# Altium schematic sheet USB_C.SchDoc
size A4; SheetNumber: 3; SheetTotal: 3
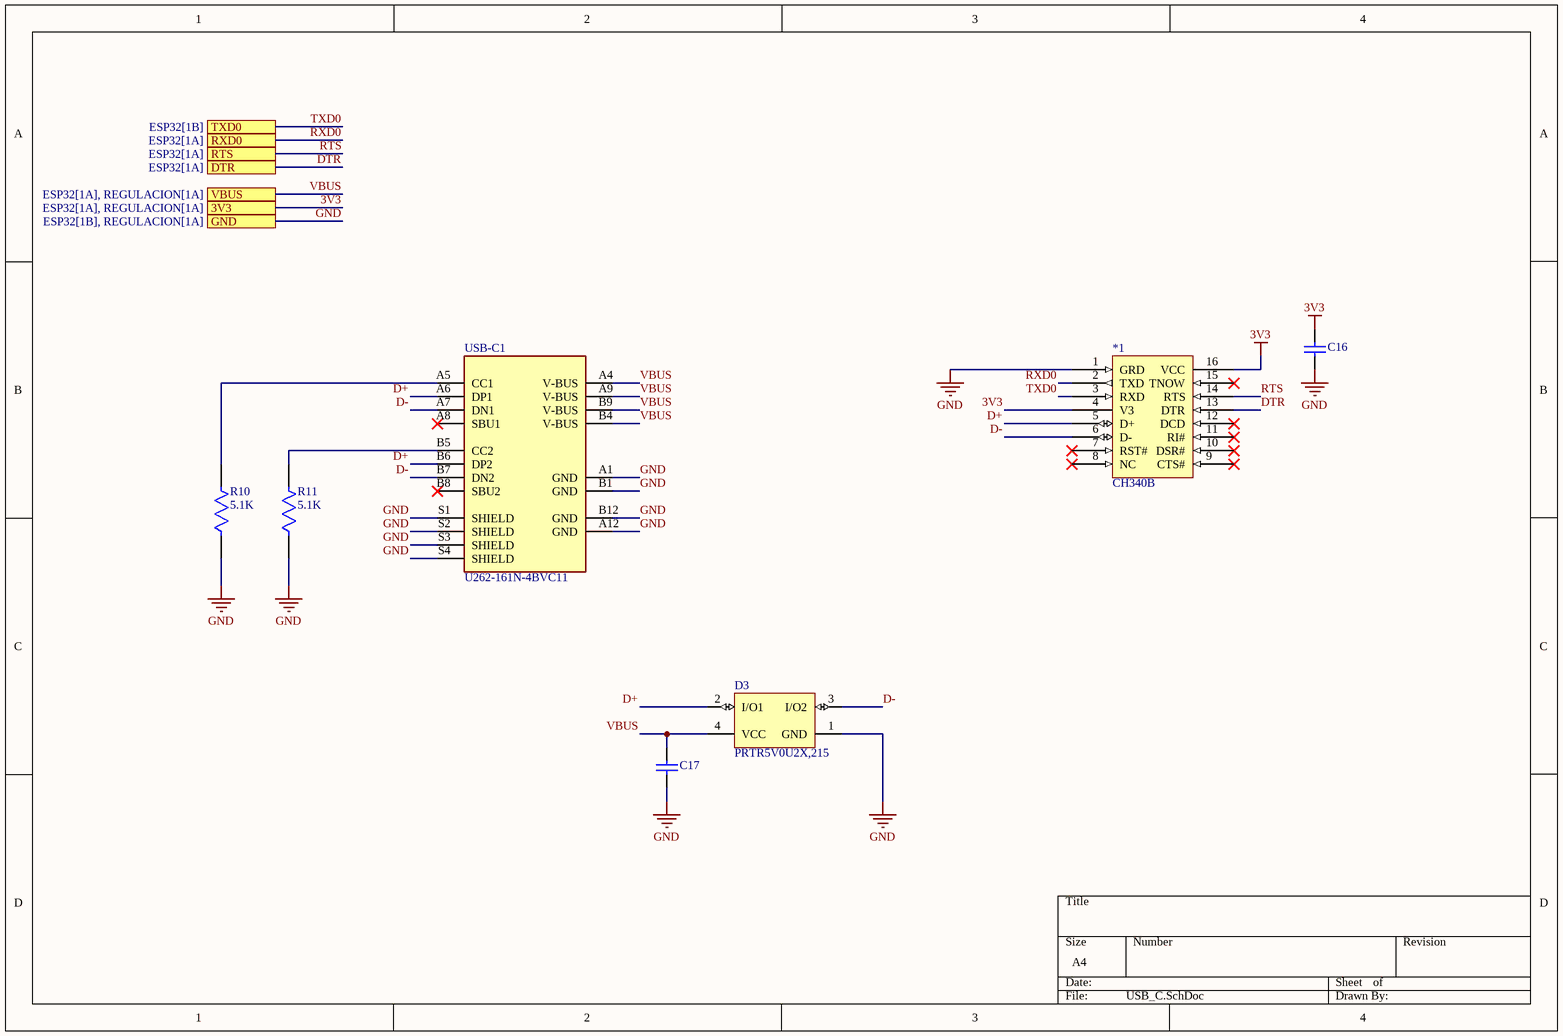
[diagram p0: USB_C.SchDoc]

## Parts
*1  CH340B  [CH340B]
C16  08055C104KAT2A  [CAPC2013X94X50ML20T25]  (value not drawn)
C17  08055C104KAT2A  [CAPC2013X94X50ML20T25]  (value not drawn)
D3  PRTR5V0U2X,215  [NXP-SOT143B-4_V]
R10  5.1K  [FP-CRCW0805-e3-MFG]
R11  5.1K  [FP-CRCW0805-e3-MFG]
USB-C1  U262-161N-4BVC11  [U262-161N-4BVC11]

## Ports
3V3 (see ESP32[1A], REGULACION[1A]), DTR (see ESP32[1A]), GND (see ESP32[1B], REGULACION[1A]), RTS (see ESP32[1A]), RXD0 (see ESP32[1A]), TXD0 (see ESP32[1B]), VBUS (see ESP32[1A], REGULACION[1A])

## Nets
3V3: *1.4(V3) *1.16(VCC) C16.2 ; port 3V3
GND: *1.1(GRD) C16.1 C17.1 D3.1(GND) R10.1 R11.1 USB-C1.A1(GND) USB-C1.A12(GND) USB-C1.B1(GND) USB-C1.B12(GND) USB-C1.S1(SHIELD) USB-C1.S2(SHIELD) USB-C1.S3(SHIELD) USB-C1.S4(SHIELD) ; port GND
D+: *1.5(D+) D3.2(I/O1) USB-C1.A6(DP1) USB-C1.B6(DP2)
D-: *1.6(D-) D3.3(I/O2) USB-C1.A7(DN1) USB-C1.B7(DN2)
DTR: *1.13(DTR) ; port DTR
RTS: *1.14(RTS) ; port RTS
RXD0: *1.2(TXD) ; port RXD0
TXD0: *1.3(RXD) ; port TXD0
VBUS: C17.2 D3.4(VCC) USB-C1.A4(V-BUS) USB-C1.A9(V-BUS) USB-C1.B4(V-BUS) USB-C1.B9(V-BUS) ; port VBUS
NetR10_2: R10.2 USB-C1.A5(CC1)
NetR11_2: R11.2 USB-C1.B5(CC2)

Not connected (* = marked no-connect by the designer): *1 7(RST#)* 8(NC)* 9(CTS#)* 10(DSR#)* 11(RI#)* 12(DCD)* 15(TNOW)*; USB-C1 A8(SBU1)* B8(SBU2)*

## Library data of the parts
*1 = CH340B: - USB 2.0 Transceiver 2Mbps SOP-16_150mil USB ICs ROHS; ComponentLink1Description: Datasheet; ComponentLink1URL: https://www.mpja.com/download/35227cpdata.pdf
C16 C17 = CMP-2000-05016-1: Chip Capacitor, Ceramic, 0.1 uF, 10%, 50 V, 0805, RoHS, Tape and Reel; Manufacturer: AVX; Rated Voltage: 50V; Capacitance: 100nF; Dielectric: X7R; Case Size/Dimension: 0805; Tolerance (%): ±10%; Datasheet URL: http://www.farnell.com/datasheets/319609.pdf; Datasheet Version: Sep-07; Manufacturer URL: http://www.avx.com/
D3 = CMP-2000-05285-1: Ultra Low Capacitance Double Rail-to-Rail ESD Protection Diode, 5.5 V, 1 pF, -40 to 85 degC, 4-Pin SOT143B, RoHS, Tape and Reel; Manufacturer: NXP Semiconductors; Capacitance Value: 16pF; Number of Elements: 1; Rad Hardened: No; Reverse Breakdown Voltage: 6V; Working Voltage (Max): 5.5V; Polarity: Uni-Directional; Configuration: Quad; Leakage Current: 0.1uA; Product Height (mm): 1mm; Suppressor Type: DiodeArrays; Product Length (mm): 3mm; Product Depth (mm): 1.4mm; ESD Protection Voltage: 8KV@ContactDisc; Package Type: SOT; Mounting: SurfaceMount; Packaging: TapeandReel; Datasheet Version: Rev. 02, 01/2008; Reverse Stand-off Voltage: 5.5V; Manufacturer URL: http://www.nxp.com/; Operating Temp Range: -40Cto85C; Operating Temperature Classification: Industrial; Working Voltage: 5.5V; Operating Temperature Min Deg. C: -40C; Datasheet URL: https://datasheet.ciiva.com/4479/prtr5v0u2x-102853-4479461.pdf; Leakage Current (Max): 0.1uA; Direction Type: Uni-Directional; Pin Count: 3+Tab; Operating Temperature Max Deg. C: 85C; Mounting Style: SurfaceMount; Package / Case: SOT
R10 R11 = CMP-2001-04024-2: RES Thick Film, 5.1kΩ, 1%, 0.125W, 100ppm/°C, 0805; Power Rating: 125mW; Voltage Rating (DC): 150V; Resistance: 5.1kR; Packaging: Tape and Reel; Case Code (Metric): 2012; Contact Plating: Tin; Case Code (Imperial): 0805; Depth: 1.25mm; Tolerance: 1%; Width: 0.049inch; Temperature Coefficient: 100ppm/°C; Max Power Dissipation: 125mW; Military Standard: Not; Lead Free: Lead Free; Mount: Surface Mount; Min Operating Temperature: -55°C; Package Quantity: 10; Weight: 0.000194oz; Height: 0.45mm; Number of Terminations: 2; Max Operating Temperature: 155°C; Termination: SMD/SMT; Case/Package: 0805; Composition: Thick Film; Voltage Rating: 150V; Length: 2mm; Features: Automotive AEC-Q200; Radiation Hardening: No
USB-C1 = U262-161N-4BVC11: USB - Type C Female 16 SMT USB Connectors RoHS; ComponentLink1Description: datasheet; ComponentLink1URL: https://datasheet.lcsc.com/szlcsc/2002271811_XKB-Connectivity-U262-161N-4BVC11_C319148.pdf; ComponentLink2Description: LCSC Link; ComponentLink2URL: https://lcsc.com/product-detail/USB-Connectors_XKB-Connectivity-U262-161N-4BVC11_C319148.html